# EAGLE design SmartWatch (EAGLE 7.4.0)
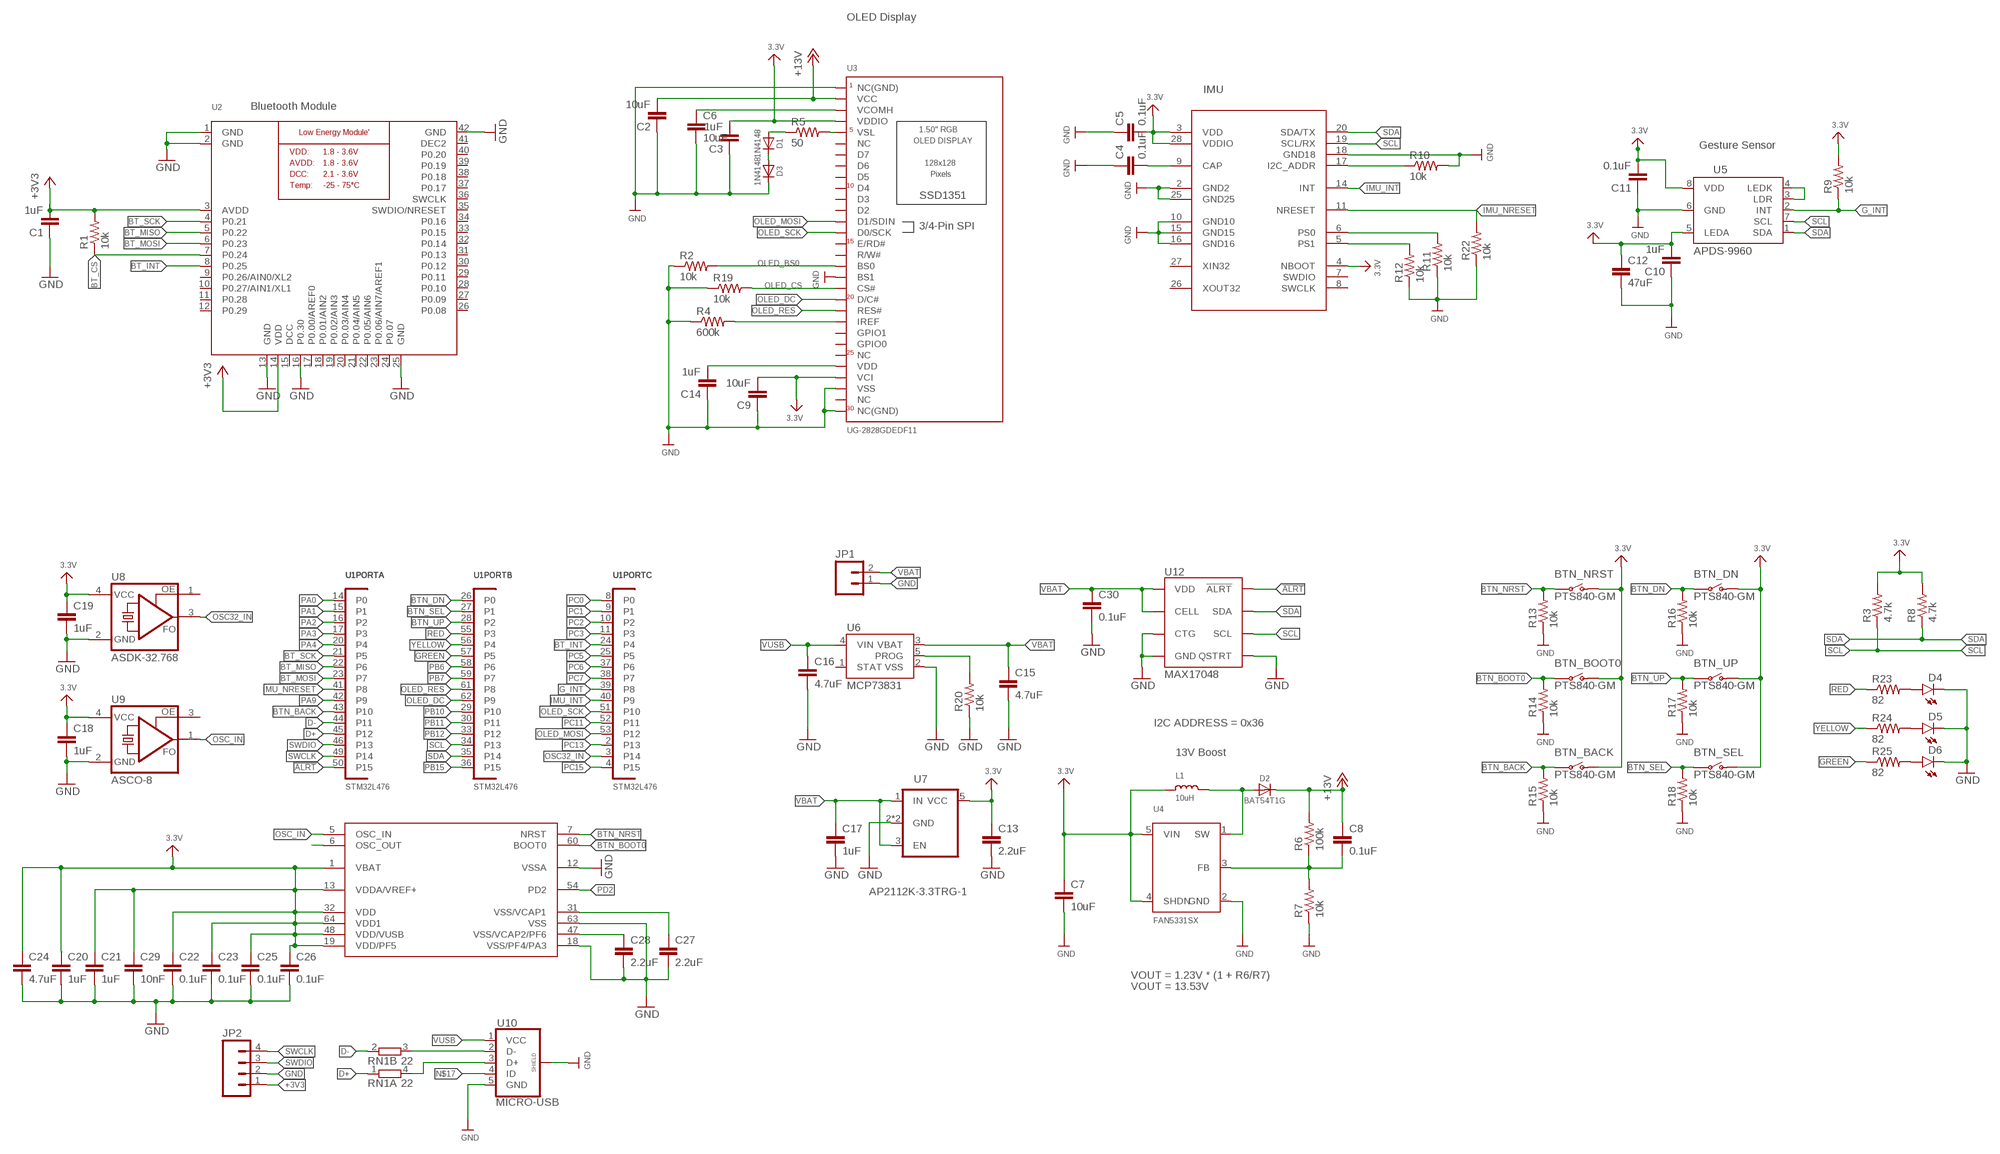
[diagram p0: schematic, sheet 1, part 1 of 2]
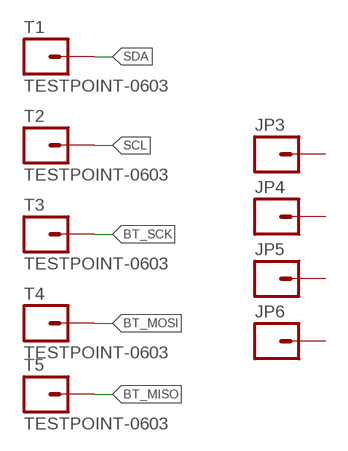
[diagram p1: schematic, sheet 1, part 2 of 2]

## Parts
BTN_BACK  PTS840-GM  [PTS840-GM]
BTN_BOOT0  PTS840-GM  [PTS840-GM]
BTN_DN  PTS840-GM  [PTS840-GM]
BTN_NRST  PTS840-GM  [PTS840-GM]
BTN_SEL  PTS840-GM  [PTS840-GM]
BTN_UP  PTS840-GM  [PTS840-GM]
C1  1uF  C-EUC0603  [C0603]
C2  10uF  C-EUC0603  [C0603]
C3  1uF  C-EUC0603  [C0603]
C4  0.1uF  C-EUC0603  [C0603]
C5  0.1uF  C-EUC0603  [C0603]
C6  10uF  C-EUC0603  [C0603]
C7  10uF  C-EUC0603  [C0603]
C8  0.1uF  C-EUC0603  [C0603]
C9  10uF  C-EUC0603  [C0603]
C10  1uF  C-EUC0603  [C0603]
C11  0.1uF  C-EUC0603  [C0603]
C12  47uF  C-EUC1206  [C1206]
C13  2.2uF  C-EUC0603  [C0603]
C14  1uF  C-EUC0603  [C0603]
C15  4.7uF  C-EUC0603  [C0603]
C16  4.7uF  C-EUC0603  [C0603]
C17  1uF  C-EUC0603  [C0603]
C18  1uF  C-EUC0603  [C0603]
C19  1uF  C-EUC0603  [C0603]
C20  1uF  C-EUC0603  [C0603]
C21  1uF  C-EUC0603  [C0603]
C22  0.1uF  C-EUC0603  [C0603]
C23  0.1uF  C-EUC0603  [C0603]
C24  4.7uF  C-EUC0603  [C0603]
C25  0.1uF  C-EUC0603  [C0603]
C26  0.1uF  C-EUC0603  [C0603]
C27  2.2uF  C-EUC0603  [C0603]
C28  2.2uF  C-EUC0603  [C0603]
C29  10nF  C-EUC0603  [C0603]
C30  0.1uF  C-EUC0603  [C0603]
D1  1N4148  DIODESOD-323  [SOD-323]
D2  BAT54T1G  DIODESOD-123  [SOD-123]
D3  1N4148  DIODESOD-323  [SOD-323]
D4  LED0603  [LED-0603]
D5  LED0603  [LED-0603]
D6  LED0603  [LED-0603]
JP1  M021X02_NO_SILK  [1X02_NO_SILK]
JP2  M04NO_SILK_ALL_ROUND  [1X04_NO_SILK_ALL_ROUND]
JP3  M01PTH_NO_SILK_YES_STOP  [1X01_NO_SILK]
JP4  M01PTH_NO_SILK_YES_STOP  [1X01_NO_SILK]
JP5  M01PTH_NO_SILK_YES_STOP  [1X01_NO_SILK]
JP6  M01PTH_NO_SILK_YES_STOP  [1X01_NO_SILK]
L1  10uH  INDUCTOR  [INDUCTOR_1007]
R1  10k  R-US_R0603  [R0603]
R2  10k  R-US_R0603  [R0603]
R3  4.7k  R-US_R0603  [R0603]
R4  600k  R-US_R0603  [R0603]
R5  50  R-US_R0603  [R0603]
R6  100k  R-US_R0603  [R0603]
R7  10k  R-US_R0603  [R0603]
R8  4.7k  R-US_R0603  [R0603]
R9  10k  R-US_R0603  [R0603]
R10  10k  R-US_R0603  [R0603]
R11  10k  R-US_R0603  [R0603]
R12  10k  R-US_R0603  [R0603]
R13  10k  R-US_R0603  [R0603]
R14  10k  R-US_R0603  [R0603]
R15  10k  R-US_R0603  [R0603]
R16  10k  R-US_R0603  [R0603]
R17  10k  R-US_R0603  [R0603]
R18  10k  R-US_R0603  [R0603]
R19  10k  R-US_R0603  [R0603]
R20  10k  R-US_R0603  [R0603]
R22  10k  R-US_R0603  [R0603]
R23  82  R-US_R0603  [R0603]
R24  82  R-US_R0603  [R0603]
R25  82  R-US_R0603  [R0603]
RN1  22  2R-NEXBV4V  [EXBV4V]
T1  TESTPOINT-0603  [TESTPOINT-0603]
T2  TESTPOINT-0603  [TESTPOINT-0603]
T3  TESTPOINT-0603  [TESTPOINT-0603]
T4  TESTPOINT-0603  [TESTPOINT-0603]
T5  TESTPOINT-0603  [TESTPOINT-0603]
U1  STM32L476  [TQFP64-10X10]
U2  NRF51822_MODULE_MDBT40  [BLE_MODULE_RAYTAC_MDBT40]
U3  UG-2828GDEDF11  DISP_OLED_UG-2828GDEDF11BOTTOM  [FPC_XF2M-3015-1A]
U4  FAN5331SX  FAN5331  [SOT23-5$1]
U5  APDS-9960  [APDS-9960]
U6  MCP73831  [SOT23-5]
U7  AP2112K-3.3TRG-1  LDO-TPS78233  [SOT23-5]
U8  ASDK-32.768  [ASDK-32.768]
U9  ASCO-8  [ASCO-8]
U10  MICRO-USB  [MICRO-USB]
U11  BNO055  [LGA28]
U12  MAX17048  MAX17048DFN8  [DFN-8]

## Nets
13V: C2.2 C8.1 D2.C R6.2 U3.P$2(VCC) ; supply symbol labelled +13V
!ALRT: U1.50(PORTA:P15) U12.P$5(!ALRT)
+3V3: BTN_BACK.3 BTN_BACK.4 BTN_BOOT0.3 BTN_BOOT0.4 BTN_DN.3 BTN_DN.4 BTN_NRST.3 BTN_NRST.4 BTN_SEL.3 BTN_SEL.4 BTN_UP.3 BTN_UP.4 C1.2 C3.2 C5.2 C7.1 C9.2 C10.2 C11.2 C12.1 C13.1 C18.1 C19.1 C20.1 C21.1 C22.1 C23.1 C24.1 C25.1 C26.1 C29.1 JP2.1 L1.P$1 R1.2 R3.2 R8.2 R9.2 U1.1(VBAT) U1.13(VDDA/VREF+) U1.19(VDD/PF5) U1.32(VDD) U1.48(VDD/VUSB) U1.64(VDD1) U2.3(AVDD) U2.14(VDD) U3.P$4(VDDIO) U3.P$27(VCI) U4.4(SHDN) U4.5(VIN) U5.5(LEDA) U5.8(VDD) U7.5(VCC) U8.4(VCC) U9.4(VCC) U11.3(VDD) U11.4(NBOOT) U11.28(VDDIO) ; supply symbol labelled 3.3V
BT_CS: R1.1 U2.7(P0.24)
BT_INT: U1.24(PORTC:P4) U2.8(P0.25)
BT_MISO: T5.1 U1.22(PORTA:P6) U2.5(P0.22)
BT_MOSI: T4.1 U1.23(PORTA:P7) U2.6(P0.23)
BT_SCK: T3.1 U1.21(PORTA:P5) U2.4(P0.21)
BTN_BACK: BTN_BACK.1 BTN_BACK.2 R15.2 U1.43(PORTA:P10)
BTN_BOOT0: BTN_BOOT0.1 BTN_BOOT0.2 R14.2 U1.60(BOOT0)
BTN_DN: BTN_DN.1 BTN_DN.2 R16.2 U1.26(PORTB:P0)
BTN_NRST: BTN_NRST.1 BTN_NRST.2 R13.2 U1.7(NRST)
BTN_SEL: BTN_SEL.1 BTN_SEL.2 R18.2 U1.27(PORTB:P1)
BTN_UP: BTN_UP.1 BTN_UP.2 R17.2 U1.28(PORTB:P2)
D+: RN1.1 U1.45(PORTA:P12)
D-: RN1.2 U1.44(PORTA:P11)
G_INT: R9.1 U1.39(PORTC:P8) U5.2(INT)
GND: C1.1 C2.1 C3.1 C4.1 C5.1 C6.2 C7.2 C9.1 C10.1 C11.1 C12.2 C13.2 C14.1 C15.2 C16.2 C17.2 C18.2 C19.2 C20.2 C21.2 C22.2 C23.2 C24.2 C25.2 C26.2 C27.2 C28.2 C29.2 C30.2 D3.C D4.C D5.C D6.C JP1.1 JP2.2 R2.1 R4.1 R7.1 R10.2 R11.1 R12.1 R13.1 R14.1 R15.1 R16.1 R17.1 R18.1 R19.1 R20.1 R22.1 U1.12(VSSA) U1.18(VSS/PF4/PA3) U1.63(VSS) U2.1(GND) U2.2(GND) U2.13(GND) U2.16(P0.30) U2.25(GND) U2.42(GND) U3.P$1(NC(GND)) U3.P$18(BS1) U3.P$28(VSS) U3.P$30(NC(GND)) U4.2(GND) U5.6(GND) U6.2(VSS) U7.2(GND) U7.4(GND) U8.2(GND) U9.2(GND) U10.5(GND) U10.6(SHIELD) U10.7(SHIELD) U10.8(SHIELD) U10.9(SHIELD) U10.10(SHIELD) U10.11(SHIELD) U11.2(GND2) U11.10(GND10) U11.15(GND15) U11.16(GND16) U11.18(GND18) U11.25(GND25) U12.P$1(CTG) U12.P$4(GND) U12.P$6(QSTRT) U12.P$9(GND)
GREEN: R25.1 U1.57(PORTB:P5)
ID: RN1.4 U10.3(D+)
IMU_INT: U1.40(PORTC:P9) U11.14(INT)
IMU_NRESET: R22.2 U1.41(PORTA:P8) U11.11(NRESET)
N$1: R4.2 U3.P$22(IREF)
N$2: C14.2 U3.P$26(VDD)
N$3: R10.1 U11.17(I2C_ADDR)
N$4: C4.2 U11.9(CAP)
N$5: D2.A L1.P$2 U4.1(SW)
N$6: R5.2 U3.P$5(VSL)
N$7: D1.A R5.1
N$8: C8.2 R6.1 R7.2 U4.3(FB)
N$9: U5.3(LDR) U5.4(LEDK)
N$10: RN1.3 U10.2(D-)
N$11: D1.C D3.A
N$13: R12.2 U11.5(PS1)
N$14: R11.2 U11.6(PS0)
N$15: U1.6(OSC_OUT)
N$16: D4.A R23.2
N$17: U10.4(ID)
N$18: D5.A R24.2
N$19: D6.A R25.2
N$27: C27.1 U1.31(VSS/VCAP1)
N$29: C28.1 U1.47(VSS/VCAP2/PF6)
OLED_BS0: R2.2 U3.P$17(BS0)
OLED_CS: R19.2 U3.P$19(CS#)
OLED_DC: U1.62(PORTB:P9) U3.P$20(D/C#)
OLED_MOSI: U1.53(PORTC:P12) U3.P$13(D1/SDIN)
OLED_RES: U1.61(PORTB:P8) U3.P$21(RES#)
OLED_SCK: U1.51(PORTC:P10) U3.P$14(D0/SCK)
OSC32_IN: U1.3(PORTC:P14) U8.3(FO)
OSC_IN: U1.5(OSC_IN) U9.1(FO)
PA0: U1.14(PORTA:P0)
PA1: U1.15(PORTA:P1)
PA2: U1.16(PORTA:P2)
PA3: U1.17(PORTA:P3)
PA4: U1.20(PORTA:P4)
PA9: U1.42(PORTA:P9)
PB6: U1.58(PORTB:P6)
PB7: U1.59(PORTB:P7)
PB10: U1.29(PORTB:P10)
PB11: U1.30(PORTB:P11)
PB12: U1.33(PORTB:P12)
PB15: U1.36(PORTB:P15)
PC0: U1.8(PORTC:P0)
PC1: U1.9(PORTC:P1)
PC2: U1.10(PORTC:P2)
PC3: U1.11(PORTC:P3)
PC5: U1.25(PORTC:P5)
PC6: U1.37(PORTC:P6)
PC7: U1.38(PORTC:P7)
PC11: U1.52(PORTC:P11)
PC13: U1.2(PORTC:P13)
PC15: U1.4(PORTC:P15)
PD2: U1.54(PD2)
PROG: R20.2 U6.5(PROG)
RED: R23.1 U1.55(PORTB:P3)
SCL: R3.1 T2.1 U1.34(PORTB:P13) U5.7(SCL) U11.19(SCL/RX) U12.P$7(SCL)
SDA: R8.1 T1.1 U1.35(PORTB:P14) U5.1(SDA) U11.20(SDA/TX) U12.P$8(SDA)
SWCLK: JP2.4 U1.49(PORTA:P14)
SWDIO: JP2.3 U1.46(PORTA:P13)
VBAT: C15.1 C17.1 C30.1 JP1.2 U6.3(VBAT) U7.1(IN) U7.3(EN) U12.P$2(CELL) U12.P$3(VDD)
VCOMH1: C6.1 U3.P$3(VCOMH)
VUSB: C16.1 U6.4(VIN) U10.1(VCC)
YELLOW: R24.1 U1.56(PORTB:P4)
Unconnected: JP3.1 JP4.1 JP5.1 JP6.1 U2.9(P0.26/AIN0/XL2) U2.10(P0.27/AIN1/XL1) U2.11(P0.28) U2.12(P0.29) U2.17(P0.00/AREF0) U2.18(P0.01/AIN2) U2.19(P0.02/AIN3) U2.20(P0.03/AIN4) U2.21(P0.04/AIN5) U2.22(P0.05/AIN6) U2.23(P0.06/AIN7/AREF1) U2.24(P0.07) U2.26(P0.08) U2.27(P0.09) U2.28(P0.10) U2.29(P0.11) U2.30(P0.12) U2.31(P0.13) U2.32(P0.14) U2.33(P0.15) U2.34(P0.16) U2.35(SWDIO/NRESET) U2.36(SWCLK) U2.37(P0.17) U2.38(P0.18) U2.39(P0.19) U2.40(P0.20) U3.P$6(NC) U3.P$7(D7) U3.P$8(D6) U3.P$9(D5) U3.P$10(D4) U3.P$11(D3) U3.P$12(D2) U3.P$15(E/RD#) U3.P$16(R/W#) U3.P$23(GPIO1) U3.P$24(GPIO0) U3.P$25(NC) U3.P$29(NC) U6.1(STAT) U8.1(OE) U9.3(OE) U11.7(SWDIO) U11.8(SWCLK) U11.26(XOUT32) U11.27(XIN32)

## Notes on the sheet
- OLED Display
- IMU
- Bluetooth Module
- Gesture Sensor
- I2C ADDRESS = 0x36
- 13V Boost
- VOUT = 1.23V * (1 + R6/R7)
- VOUT = 13.53V

## Power pins joined to a net without a drawn wire
DCC: U2.15(DCC)
DEC2: U2.41(DEC2)

## Library data of the parts
BTN_BACK BTN_BOOT0 BTN_DN BTN_NRST BTN_SEL BTN_UP = SmartWatch:PTS840-GM
C1-C14 = resistor:C-EU: CAPACITOR, European symbol
C15 C16 C20-C30 = resistor:C-EU: CAPACITOR, European symbol; PROD_ID: CAP-08280
C17-C19 = resistor:C-EU: CAPACITOR, European symbol; PROD_ID: CAP-00868
D1-D3 = microbuilder:DIODE: Diode SMA Model Volts Amps Type Vf Ir Digikey # Notes SSA34-E3 40V 3A Schottky 480mV @ 3A 200uA @ 40V SSA34-E3/61TGITR-ND CDBA120-G 20V 1A Schottky 500mV @ 1A 500uA @ 20V 641-1014-6-ND REEL MBRA210 10V 2A Schottky 350mV @ 2A 700uA @ 10V MBRA210LT3 SOD-123 Model Volts Amps Type Vf Ir Order # Notes BAT54T1G 30V 200mA Schottky 800mV @ 200mA 2uA @ 25V BAT54T1GOSTR-ND B0530W 30V 500mA Schottky 430mV @ 500mA 130uA @ 30V B0530W-FDICT-ND REEL MBR120 20V 1A Schottky 340mV @ 1A MBR120VLSFT1GOSCT-ND SOD-323 Model Volts Amps Type Vf Ir Order # Notes PMEG2005EJ 20V 500mA Schottky 355mV @ 500mA 568-4110-1-ND ZLLS410 10V 570mA Schottky 380mV @ 570mA ZLLS410CT-ND 1N4148WS 75V 150mA Silicon/Simple 1V 1N4148WSFSCT-ND REEL SOD-523 Model Volts Amps Type Vf Ir Order # Notes BAT54XV2 30V 200mA Schottky 0.8V @ 100mA BAT54XV2CT-ND TB751S 30V 30mA Schottky RB751S-40TE61CT-ND SOT23-R/W (R = Solder Paste/Reflow Ovens, W = Hand-Soldering) Model Volts Amps Type Vf Ir Order # Notes BAT54FILM 40V 300mA Schottky 497-7162-1-ND POWERDI-5 Model Volts Amps Type Vf Ir Order # Notes PDS560 60V 5A Schottky 670mV @ 5A 150uA @ 60V PDS560DICT-ND
D4-D6 = SparkFun-LED:LED: LEDs Standard schematic elements and footprints for 5mm, 3mm, 1206, and 0603 sized LEDs. 5mm - Spark Fun Electronics SKU : COM-00529 (and others)
JP1 = SparkFun-Connectors:M02: Standard 2-pin 0.1" header. Use with - straight break away headers ( PRT-00116) - right angle break away headers (PRT-00553) - swiss pins (PRT-00743) - machine pins (PRT-00117) - female headers (PRT-00115) Molex polarized connector foot print use with: PRT-08233 with associated crimp pins and housings. 2.54_SCREWTERM for use with PRT-10571. 3.5mm Screw Terminal footprints for PRT-08084 5mm Screw Terminal footprints for use with PRT-08432
JP2 = SparkFun-Connectors:M04: Header 4 Standard 4-pin 0.1" header. Use with straight break away headers (SKU : PRT-00116), right angle break away headers (PRT-00553), swiss pins (PRT-00743), machine pins (PRT-00117), and female headers (PRT-00115). Molex polarized connector foot print use with SKU : PRT-08231 with associated crimp pins and housings. 1MM SMD Version SKU: PRT-10208
JP3-JP6 = SparkFun-Connectors:M01: Header 1 Standard 1-pin 0.1" header. Use with straight break away headers (SKU : PRT-00116), right angle break away headers (PRT-00553), swiss pins (PRT-00743), machine pins (PRT-00117), and female headers (PRT-00115).
L1 = microbuilder:INDUCTOR: Inductors 0603: 10nH Ceramic Inductor - microwire antenna/RF (Digikey: 712-1434-2-ND) 0805: 560nH Ceramic Inductor - RF (Digikey: 553-1047-1-ND) 270nH Ceramic Inductor - Q = 40@250MHz, +-5%, 1 Ohm DC Resistance (Digikey: 535-10506-2-ND) 1007 (2518 Metric) SMT: 10µH 10% 250mOhm 820mA 1007 Inductor (Digikey: 587-2189-1-ND) 22µH 10% 500mOhm 580mA 1007 Inductor (Digikey: 587-2190-1-ND) 47µH 10% 950mOhm 420mA 1007 Inductor (Digikey: 587-2191-1-ND) 47µH 5% 100mOhm 1A 1008 Inductor (Digikey: 732-1816-1-ND) 5.0x5.0mm (Taiyo Yuden NR5040 Series) 6.8µH 20% 2.3A 64mOhm Inductor (Digikey: 587-2374-2-ND) 5.0x5.0mm (TDK VLC5045 Series) 4.7µH 20% 3.3A 34mOhm Inductor (Digikey: 445-6526-1-ND) 6.8µH 20% 2.7A 46mOhm Inductor (Digikey: 445-6527-1-ND) 6.0x6.0mm (TDK VLC6045 Series) 4.7µH 20% 3.8A 27mOhm Inductor (Digikey: 445-6538-2-ND) 6.8µH 20% 3A 41mOhm Inductor (Digikey: 445-6540-1-ND) 6.2µH 30% 2.2A 45mOhm Inductor (Digikey: SRR5028-6R2YCT-ND) - Not TDK VLC6045 but footprint should match 6.0x6.0mm (TDK SLF6045 Series) 6.8uH 30% 2A 33mOhm Inductor (Digikey: 445-4572-1-ND, Mouser: 810-SLF645T6R8N2R0PF) 6.0x6.0mm (Sumida CDRH5D28 Series) 6.2uH 30% 1.8A 45mOhm Inductor (Digikey: 308-1542-1-ND) Taiyo Yuden NR3015T2R2M - 2.2uH 20% 1.5A (Digikey: 587-1648-2-ND, Mouser: 963-NR3015T2R2M) - Used with TI TPS62172 CoilCraft RFID Transponder Coil - MA5532-AE (For use with AS3935 Lightning Sensor)
R1-R20 R22-R25 = resistor:R-US_: RESISTOR, American symbol
RN1 = MicroBoard:2R-N: Array Chip Resistor; DIGIKEY: RHM1381CT-ND; MF: Rohm Semiconductor; MPN: MNR12ERAPJ220
T1-T5 = SmartWatch:TESTPOINT-0603
U1 = SmartWatch:STM32L476
U2 = SmartWatch:NRF51822_MODULE_MDBT40: nRF51822 Bluetooth Low Energy Module
U3 = SmartWatch:DISP_OLED_UG-2828GDEDF11: 128x128 1.5" RGB OLED - UG-2828GDEDF11 30-Pin 0.5mm Pitch FPC Cable (Top+Bottom Contacts) - OMRON XF2M-3015-1A (Digikey: OR723TR-ND) This FPC connector has contacts on the top and bottom, but the appropriate pin needs to be selected depending on whether the OLED will be inserted right-side up (use the TOP pinout) or upside-down (use the BOTTOM pinout).
U4 = SmartWatch:FAN5331: FAN5331 - LED/OLED 20V Boost Converter Digikey: FAN5331SXCT-ND
U5 = SparkFun-Sensors:APDS-9960: Avago APDS-9960 digital proximity, ambient light, RGB, and gesture sensor.; PROD_ID: SEN-12005
U6 = SparkFun:MCP73831: Microchip's MCP73831 Miniature single cell, fully integrated Li-Ion, Li-polymer charge management controller http://ww1.microchip.com/downloads/en/DeviceDoc/21984a.pdf; PROD_ID: IC-09995
U7 = SparkFun-PowerIC:LDO-TPS78233: Voltage Regulator LDO 500nA Ground Current, 150mA, Ultra-Low Quiescent Current Low-Dropout Linear Regulator.; PROD_ID: VREG-12457
U8 = SmartWatch:ASDK-32.768
U9 = SmartWatch:ASCO-8
U10 = SmartWatch:MICRO-USB
U11 = SmartWatch:BNO055
U12 = SparkFun-DigitalIC:MAX17048: Micropower 1-Cell Li+ ModelGauge; PROD_ID: IC-12551

## Board
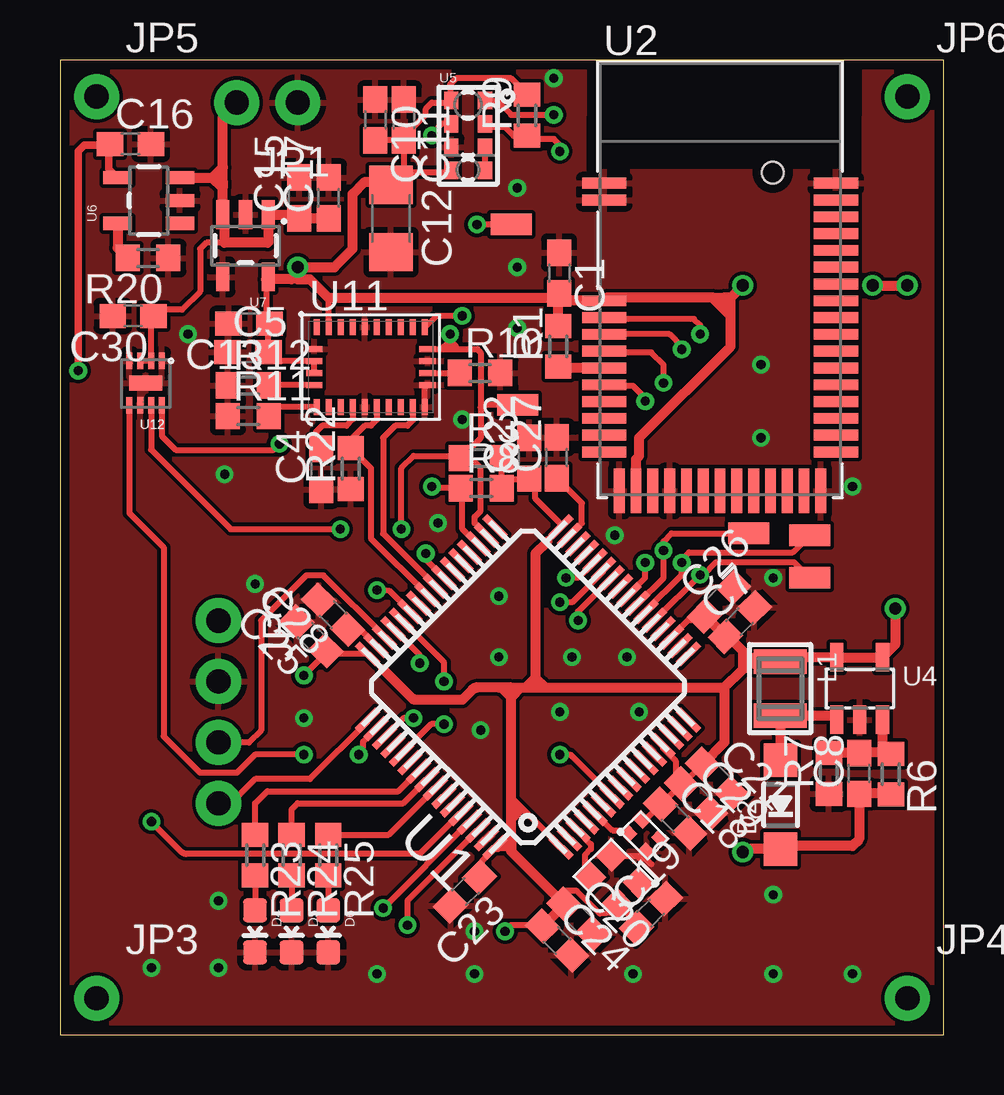
[diagram p2: board, top side]
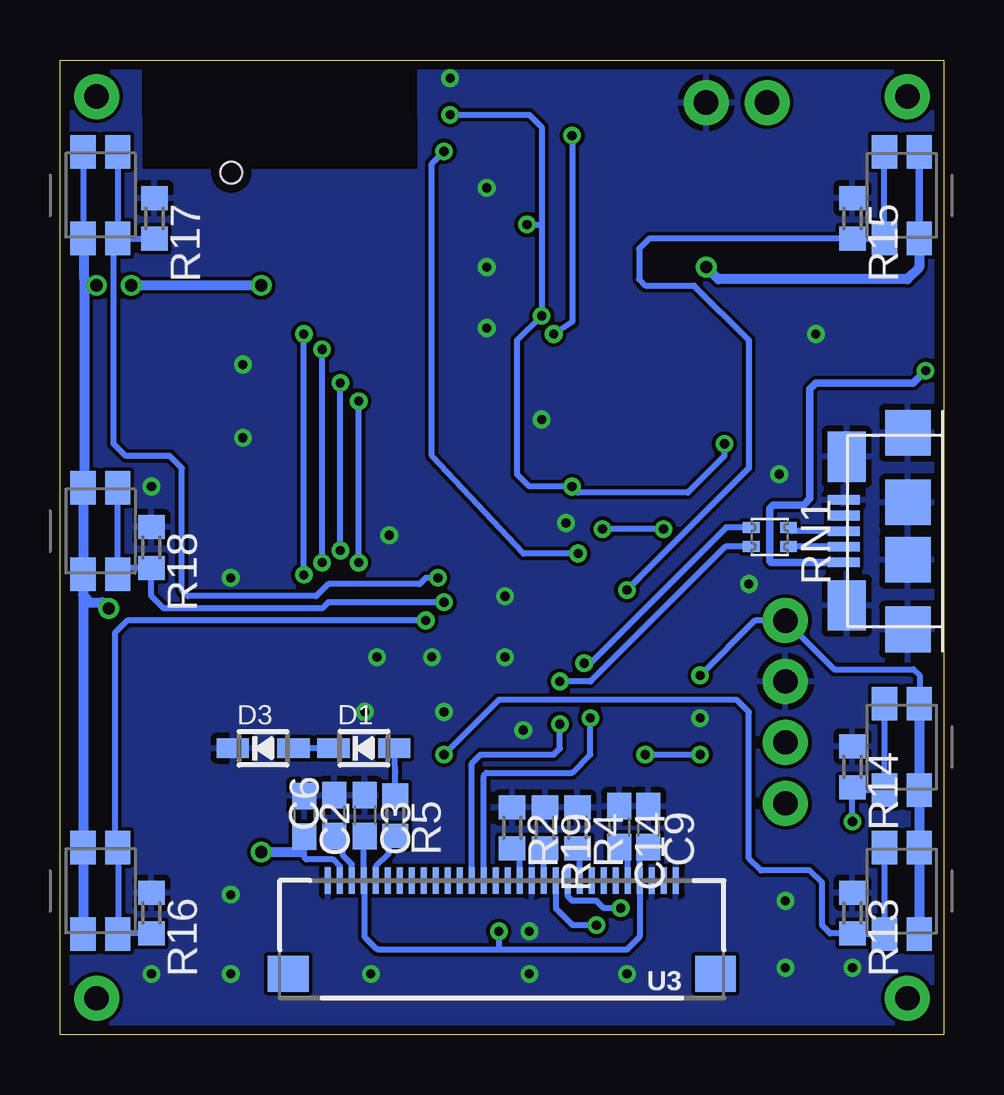
[diagram p3: board, bottom side, seen from below]

Size 36.83 x 40.64 mm. Coordinates in mm from the lower left corner, seen from the top.
Outline: 0,0 36.83,0 36.83,40.64 0,40.64 0,0
Copper layers (1*16): Top 0.0356mm / dielectric 1.5011mm / Bottom 0.0356mm
Design rules "LaenPCBOrder": minimum track width 6mil, minimum drill 13mil, track to track 6mil, track to pad 6mil, pad to pad 6mil, via to via 6mil, smd to smd 6mil, copper to edge 15mil, drill to drill 6mil, minimum pad ring 7mil, minimum via ring 7mil, stop-mask expansion 3mil, vias tented up to drill 0mil, thermal gap 10mil

### Footprints (pad centres in the part's own frame; a part is rotated, then mirrored left to right if it is on the bottom)
PTS840-GM = smd 1.4 x 1.05: 1 -1.8,0.725; 2 1.8,0.725; 3 -1.8,-0.725; 4 1.8,-0.725
C0603 = smd 1.1 x 1: 1 -0.85,0; 2 0.85,0
C1206 = smd 1.6 x 1.8: 1 -1.4,0; 2 1.4,0
SOD-323 = smd 1.35 x 0.8: A 1.27,0; C -1.27,0
SOD-123 = smd 1.4 x 1.4: A 1.85,0; C -1.85,0
LED-0603 = smd 1 x 1: A 0,-0.877; C 0,0.877
1X02_NO_SILK = drill 1.016 pad 1.88: 1 0,0; 2 2.54,0
1X04_NO_SILK_ALL_ROUND = drill 1.016 pad 1.88: 1 0,0; 2 2.54,0; 3 5.08,0; 4 7.62,0
1X01_NO_SILK = drill 1.016 pad 1.88: 1 0,0
INDUCTOR_1007 = smd 1.016 x 2.2: P$1 -1.127,0; P$2 1.127,0
R0603 = smd 1 x 1.1: 1 -0.85,0; 2 0.85,0
EXBV4V = smd 0.45 x 0.7: 1 -0.4,-0.775; 2 0.4,-0.775; 3 0.4,0.775; 4 -0.4,0.775
TESTPOINT-0603 = smd 1.7 x 0.9: 1 0,0
TQFP64-10X10 = smd 1.2 x 0.3: 1 -5.7,3.75; 2 -5.7,3.25; 3 -5.7,2.75; 4 -5.7,2.25; 5 -5.7,1.75; 6 -5.7,1.25; 7 -5.7,0.75; 8 -5.7,0.25; 9 -5.7,-0.25; 10 -5.7,-0.75; 11 -5.7,-1.25; 12 -5.7,-1.75; 13 -5.7,-2.25; 14 -5.7,-2.75; 15 -5.7,-3.25; 16 -5.7,-3.75; 33 5.7,-3.75; 34 5.7,-3.25; 35 5.7,-2.75; 36 5.7,-2.25; 37 5.7,-1.75; 38 5.7,-1.25; 39 5.7,-0.75; 40 5.7,-0.25; 41 5.7,0.25; 42 5.7,0.75; 43 5.7,1.25; 44 5.7,1.75; 45 5.7,2.25; 46 5.7,2.75; 47 5.7,3.25; 48 5.7,3.75 | smd 0.3 x 1.2: 17 -3.75,-5.7; 18 -3.25,-5.7; 19 -2.75,-5.7; 20 -2.25,-5.7; 21 -1.75,-5.7; 22 -1.25,-5.7; 23 -0.75,-5.7; 24 -0.25,-5.7; 25 0.25,-5.7; 26 0.75,-5.7; 27 1.25,-5.7; 28 1.75,-5.7; 29 2.25,-5.7; 30 2.75,-5.7; 31 3.25,-5.7; 32 3.75,-5.7; 49 3.75,5.7; 50 3.25,5.7; 51 2.75,5.7; 52 2.25,5.7; 53 1.75,5.7; 54 1.25,5.7; 55 0.75,5.7; 56 0.25,5.7; 57 -0.25,5.7; 58 -0.75,5.7; 59 -1.25,5.7; 60 -1.75,5.7; 61 -2.25,5.7; 62 -2.75,5.7; 63 -3.25,5.7; 64 -3.75,5.7
BLE_MODULE_RAYTAC_MDBT40 = smd 1.85 x 0.45: 1 -4.825,4; 2 -4.825,3.3; 3 -4.825,-0.9; 4 -4.825,-1.6; 5 -4.825,-2.3; 6 -4.825,-3; 7 -4.825,-3.7; 8 -4.825,-4.4; 9 -4.825,-5.1; 10 -4.825,-5.8; 11 -4.825,-6.5; 12 -4.825,-7.2; 26 4.825,-7.2; 27 4.825,-6.5; 28 4.825,-5.8; 29 4.825,-5.1; 30 4.825,-4.4; 31 4.825,-3.7; 32 4.825,-3; 33 4.825,-2.3; 34 4.825,-1.6; 35 4.825,-0.9; 36 4.825,-0.2; 37 4.825,0.5; 38 4.825,1.2; 39 4.825,1.9; 40 4.825,2.6; 41 4.825,3.3; 42 4.825,4 | smd 0.45 x 1.85: 13 -4.2,-8.825; 14 -3.5,-8.825; 15 -2.8,-8.825; 16 -2.1,-8.825; 17 -1.4,-8.825; 18 -0.7,-8.825; 19 0,-8.825; 20 0.7,-8.825; 21 1.4,-8.825; 22 2.1,-8.825; 23 2.8,-8.825; 24 3.5,-8.825; 25 4.2,-8.825 | hole 0.9: 2.2,4.45
FPC_XF2M-3015-1A = smd 0.25 x 1.1: P$1 7.25,-2.63; P$2 6.75,-2.63; P$3 6.25,-2.63; P$4 5.75,-2.63; P$5 5.25,-2.63; P$6 4.75,-2.63; P$7 4.25,-2.63; P$8 3.75,-2.63; P$9 3.25,-2.63; P$10 2.75,-2.63; P$11 2.25,-2.63; P$12 1.75,-2.63; P$13 1.25,-2.63; P$14 0.75,-2.63; P$15 0.25,-2.63; P$16 -0.25,-2.63; P$17 -0.75,-2.63; P$18 -1.25,-2.63; P$19 -1.75,-2.63; P$20 -2.25,-2.63; P$21 -2.75,-2.63; P$22 -3.25,-2.63; P$23 -3.75,-2.63; P$24 -4.25,-2.63; P$25 -4.75,-2.63; P$26 -5.25,-2.63; P$27 -5.75,-2.63; P$28 -6.25,-2.63; P$29 -6.75,-2.63; P$30 -7.25,-2.63 | smd 1.7 x 1.5: SUPPORT1 8.9,1.27; SUPPORT2 -8.9,1.27
SOT23-5$1 = smd 0.55 x 1.2: 1 -0.95,-1.3; 2 0,-1.3; 3 0.95,-1.3; 4 0.95,1.3; 5 -0.95,1.3
APDS-9960 = smd 0.6 x 0.72: 1 0.7,1.455; 2 0.7,0.485; 3 0.7,-0.485; 4 0.7,-1.455; 5 -0.7,-1.455; 6 -0.7,-0.485; 7 -0.7,0.485; 8 -0.7,1.455
SOT23-5 = smd 0.55 x 1.2: 1 -0.95,-1.3; 2 0,-1.3; 3 0.95,-1.3; 4 0.95,1.3; 5 -0.95,1.3
ASDK-32.768 = smd 1 x 0.9: 1 -0.812,-0.613; 2 0.812,-0.613; 3 0.812,0.613; 4 -0.812,0.613
ASCO-8 = smd 0.6 x 0.5: 1 -0.55,-0.4; 2 0.55,-0.4; 3 0.55,0.4; 4 -0.55,0.4
MICRO-USB = smd 0.4 x 1.35: 1 -1.3,2.675; 2 -0.65,2.675; 3 0,2.675; 4 0.65,2.675; 5 1.3,2.675 | smd 2.1 x 1.6: 6 -3.1,2.55; 7 3.1,2.55 | smd 1.9 x 1.9: 8 -4.1,0; 9 -1.2,0; 10 1.2,0; 11 4.1,0
LGA28 = smd 0.25 x 0.675: 1 -2.25,1.663; 6 -2.25,-1.663; 7 -1.75,-1.663; 8 -1.25,-1.663; 9 -0.75,-1.663; 10 -0.25,-1.663; 11 0.25,-1.663; 12 0.75,-1.663; 13 1.25,-1.663; 14 1.75,-1.663; 15 2.25,-1.663; 20 2.25,1.663; 21 1.75,1.663; 22 1.25,1.663; 23 0.75,1.663; 24 0.25,1.663; 25 -0.25,1.663; 26 -0.75,1.663; 27 -1.25,1.663; 28 -1.75,1.663 | smd 0.675 x 0.25: 2 -2.362,0.75; 3 -2.362,0.25; 4 -2.362,-0.25; 5 -2.362,-0.75; 16 2.362,-0.75; 17 2.362,-0.25; 18 2.362,0.25; 19 2.362,0.75
DFN-8 = smd 0.25 x 0.7: P$1 -0.688,-0.92; P$2 -0.238,-0.92; P$3 0.212,-0.92; P$4 0.662,-0.92; P$5 0.662,0.93; P$6 0.212,0.93; P$7 -0.238,0.93; P$8 -0.688,0.93 | smd 1.37 x 0.64: P$9 -0.013,0.005

### Placement (x,y rotation side)
BTN_BACK  1.75,35 90 bottom
BTN_BOOT0  1.75,12 90 bottom
BTN_DN  35.15,6 270 bottom
BTN_NRST  1.75,6 90 bottom
BTN_SEL  35.15,21 270 bottom
BTN_UP  35.15,35 270 bottom
C1  20.8,31.76 270 top
C2  26.66,9.11 270 bottom
C3  24.13,9.14 270 bottom
C4  10.89,23.58 90 top
C5  7.83,28.47 0 top
C6  25.4,9.14 90 bottom
C7  28.32,17.21 45 top
C8  33.3,10.9 90 top
C9  12.31,8.68 270 bottom
C10  13.14,38.14 270 top
C11  14.33,38.14 270 top
C12  13.79,34.03 270 top
C13  7.87,29.64 180 top
C14  13.53,8.68 270 bottom
C15  9.97,34.89 90 top
C16  2.94,37.13 0 top
C17  11.2,34.89 90 top
C18  25.63,9.01 315 top
C19  24.62,5.08 45 top
C20  21.6,4.85 315 top
C21  27.37,10.68 315 top
C22  19.55,24.04 90 top
C23  16.88,5.98 225 top
C24  20.71,3.93 315 top
C25  10.47,16.62 135 top
C26  27.46,18.06 45 top
C27  20.7,24.06 90 top
C28  11.38,17.52 135 top
C29  26.5,9.86 315 top
C30  3.05,29.97 180 top
D1  24.17,11.95 0 bottom
D2  30.02,9.6 90 top
D3  28.36,11.95 0 bottom
D4  8.13,4.32 180 top
D5  9.65,4.32 180 top
D6  11.18,4.32 180 top
JP1  9.91,38.86 180 top
JP2  6.6,17.27 270 top
JP3  1.52,1.52 0 top
JP4  35.31,1.52 0 top
JP5  1.52,39.12 0 top
JP6  35.31,39.12 0 top
L1  30.01,14.44 270 top
R1  20.76,28.71 90 top
R2  17.99,8.63 270 bottom
R3  17.55,24.05 0 top
R4  15.27,8.63 270 bottom
R5  22.86,9.14 270 bottom
R6  34.62,10.87 270 top
R7  32.04,10.9 90 top
R8  17.55,22.79 0 top
R9  19.46,38.33 90 top
R10  17.5,27.59 0 top
R11  7.85,25.8 0 top
R12  7.85,27.07 0 top
R13  3.81,5.08 270 bottom
R14  3.81,11.18 270 bottom
R15  3.81,34.04 270 bottom
R16  33.02,5.08 270 bottom
R17  32.89,34.04 270 bottom
R18  33.02,20.32 270 bottom
R19  16.62,8.63 270 bottom
R20  3.67,32.39 180 top
R22  12.12,23.61 90 top
R23  8.13,7.49 270 top
R24  9.65,7.49 270 top
R25  11.18,7.49 270 top
RN1  7.25,20.75 270 bottom
T1  18.8,33.78 180 top
T2  19.08,26.26 0 top
T3  31.24,19.05 180 top
T4  28.7,20.9 0 top
T5  31.24,20.83 180 top
U1  19.5,14.5 135 top
U2  27.5,31.5 0 top
U3  18.41,3.81 180 bottom
U4  33.32,14.44 0 top
U5  17,37.49 0 top
U6  3.7,34.78 90 top
U7  7.73,32.9 180 top
U8  23.1,6.46 135 top
U9  24.34,8.31 315 top
U10  1.5,21 90 bottom
U11  12.95,27.84 0 top
U12  3.56,27.18 180 top

### Tracks (layer width: path | path; a pad name or v marks a point on that pad's centre or on a via)
13V  (via drill 0.51)
  Top 0.406: v28.45,7.62 28.57,7.75 D2.C 30.15,7.87 33.02,7.87 33.3,8.15 C8.1 33.35,10.09 34.54,10.09 R6.2
  Bottom 0.254: U3.P$2 25.16,7.03 25.45,7.32 26.57,7.32 26.64,7.39 26.64,8.05 C2.2
  Bottom 0.406: v28.45,7.62 26.84,7.62 C2.2
!ALRT  (via drill 0.38)
  Top 0.254: U1.50 12.62,12.22 12.62,11.76 v12.45,11.68 | v10.16,11.68 8.13,11.68 7.37,10.92 5.84,10.92 4.32,12.45 4.32,20.32 2.89,21.74 U12.P$5
  Bottom 0.254: v12.45,11.68 v10.16,11.68
+3V3  (via drill 0.38, 0.51)
  Top 0.254: C29.1 24.83,9.39 24.83,9.34 C18.1 24.4,8.99 U9.4 | C29.1 25.8,10.31 C21.1 | U1.13 25.12,11.96 25.65,11.43 25.65,10.4 C29.1 | U1.19 26.19,17.3 26.31,17.3 C26.1 | U1.32 20.88,21.29 19.81,22.35 19.81,22.93 C22.1 19.78,23.17 18.77,23.17 R8.2 R3.2 | C11.2 C10.2 | R9.2 19.46,39.21 18.8,39.88 16.51,39.88 16.26,39.62 16.26,38.99 U5.8 16.21,38.86 15.49,38.86 15.24,38.61 15.24,38.35 14.33,37.45 C11.2 | C11.2 14.33,35.97 | 14.33,35.97 C12.1 | 18.23,7.82 U1.64 18.12,7.78 17.58,7.24 17.58,6.67 C23.1 | 13.46,15.24 arc-45 13.45,15.24 U1.48 11.21,15.88 C25.1 11.07,15.9 v10.16,14.99 | 18.29,14.48 18.8,13.97 19.3,14.48 19.81,14.99 20.32,14.48 | U1.32 20.88,21.13 | 20.32,20.57 20.32,20.62 U1.32 | U11.28 11.2,30.71 11.18,30.73 | U11.4 U11.3 9.12,28.09 C5.2 8.68,29.71 C13.1 8.58,29.94 8.58,31.5 | 14.33,35.97 16.23,35.97 U5.5 | C24.1 20.06,4.57 18.8,4.57 v18.54,4.32 | U1.1 19.3,9.4 | 19.3,9.4 19.05,9.65 | 19.05,9.65 18.8,9.91 | 18.8,9.4 19.05,9.65 | 19.3,9.4 18.8,8.89 18.8,9.14 19.05,9.4 | C19.1 24.07,4.63 U8.4 23.11,5.32 23.11,5.08 22.5,5.05 21.54,5.99 20.98,5.99 20.83,5.84 20.83,5.62 C20.1
  Top 0.406: U2.14 24,24 24.13,24.13 24.13,24.89 27.94,28.7 27.94,29.97 | 27.94,29.97 27.18,30.73 | 27.18,30.73 22.81,30.73 U2.3 20.84,30.6 C1.2 | 21.06,30.87 C1.2 | R1.2 20.76,30.87 C1.2 | 8.58,31.5 U7.5 8.78,31.5 9.65,31.5 9.91,31.75 v9.91,32 | v9.91,32 9.91,31.5 10.41,31.5 11.18,30.73 20.88,30.73 C1.2 | 27.94,29.97 27.94,30.48 | 27.94,30.73 27.69,30.73 | 27.18,30.73 27.69,30.73 | 27.69,30.73 27.94,30.48 | 27.94,30.48 27.94,30.73 | 27.94,30.73 v28.45,31.24 | v33.86,31.24 v35.31,31.24 | v34.8,17.78 34.8,16.27 U4.4 U4.5 30.18,15.74 L1.P$1 29.82,15.75 28.96,15.75 28.83,15.62 | C26.1 26.74,17.64 C7.1 27.74,16.71 28.45,16 | 27.69,14.48 27.69,12.19 C21.1 | 18.23,7.82 18.29,7.87 | 18.29,7.87 18.8,8.38 | 18.8,8.38 18.8,8.89 18.8,9.4 18.8,9.91 18.8,13.97 18.8,14.48 | 18.8,14.48 19.3,14.48 19.81,14.48 | 19.81,14.48 20.32,14.48 27.69,14.48 | 27.69,14.48 28.45,15.24 | 28.45,15.24 28.83,15.62 | 28.45,16 28.83,15.62 | 28.45,16 28.45,15.49 | 28.45,15.49 28.45,15.24 | 28.45,15.49 29.21,15.49 | 18.8,14.48 18.29,14.48 17.38,14.48 arc45 17.2,14.4 16.76,13.97 14.84,13.97 arc-45 14.66,14.04 13.46,15.24 | 19.81,14.48 19.81,14.99 19.81,20.07 20.32,20.57 | v9.91,32 11.43,32 12.19,32.77 12.19,35.05 12.7,35.56 13.66,35.56 C12.1 | 18.8,8.38 18.8,7.87 | 18.8,7.87 18.8,7.66 C20.1 21,5.42 C24.1 | 18.29,7.87 18.8,7.87
  Bottom 0.254: C9.2 12.66,7.47 U3.P$27 12.66,4.2 arc45 12.74,4.03 13.21,3.56 18.54,3.56 | C3.2 24.16,8.01 U3.P$4 arc45 24.13,6.36 24.13,4.06 23.7,3.63 arc-45 23.52,3.56 18.54,3.56 | BTN_UP.3 BTN_UP.4 | 9.91,14.99 v10.16,14.99 7.87,17.27 JP2.1 4.57,15.24 1.27,15.24 1.02,14.99 1.02,13.81 BTN_BOOT0.4 | v18.54,4.32 18.54,3.56
  Bottom 0.305: BTN_BACK.3 BTN_BACK.4
  Bottom 0.406: BTN_BACK.3 1.03,31.99 1.52,31.5 9.4,31.5 v9.91,32 | v28.45,31.24 v33.86,31.24 | v35.31,31.24 35.56,31.24 | 35.56,31.24 35.81,31.5 | 35.81,31.5 35.81,33.14 BTN_UP.4 | 35.81,31.5 35.81,30.99 | 35.56,31.24 35.81,30.99 | 35.81,30.99 35.81,22.86 BTN_SEL.3 BTN_SEL.4 | BTN_SEL.4 BTN_DN.3 BTN_DN.4 | BTN_SEL.4 35.87,18.34 35.56,18.03 | 35.81,18.03 35.56,18.03 | 35.56,18.03 35.05,18.03 v34.8,17.78 | BTN_BOOT0.4 BTN_BOOT0.3 BTN_NRST.4 BTN_NRST.3
BT_CS
  Top 0.406: U2.7 21.09,27.8 R1.1
BT_INT  (via drill 0.38)
  Top 0.254: U1.24 23.71,18.37 24.38,19.05 v24.38,19.68 | v24.38,26.42 24.38,26.54 23.88,27.05 22.72,27.05 U2.8
  Bottom 0.254: v24.38,19.68 v24.38,26.42
BT_MISO  (via drill 0.38)
  Top 0.254: U1.22 24.41,17.68 25.91,19.18 v25.91,19.68 25.91,19.81 26.21,20.12 30.53,20.12 T5.1 | v25.91,28.57 25.91,28.7 25.4,29.21 U2.5
  Bottom 0.254: v25.91,19.68 v25.91,28.57
BT_MOSI  (via drill 0.38)
  Top 0.254: U1.23 24.1,18 25.15,19.05 v25.15,20.19 25.15,20.57 25.48,20.9 T4.1 | v25.15,27.18 25.15,27.94 24.64,28.45 22.73,28.45 U2.6
  Bottom 0.254: v25.15,20.19 v25.15,27.18
BT_SCK  (via drill 0.38)
  Top 0.254: U1.21 24.79,17.29 v26.67,19.18 26.8,19.18 27.33,19.71 30.58,19.71 T3.1 | v26.67,29.21 26.67,29.59 26.42,29.84 22.73,29.84 U2.4
  Bottom 0.254: v26.67,19.18 v26.67,29.21
BTN_BACK  (via drill 0.38)
  Top 0.254: v13.21,18.54 13.72,18.52 U1.43
  Bottom 0.254: BTN_BACK.2 BTN_BACK.1 2.49,33.19 R15.2 12.28,33.19 12.7,32.77 12.7,31.5 12.45,31.24 10.41,31.24 8.13,28.96 8.13,23.62 v13.21,18.54 12.7,19.05
BTN_BOOT0  (via drill 0.38)
  Top 0.254: U1.60 arc45 16.65,9.21 14.99,7.54 5.26,7.54 arc-45 5.08,7.62 v3.81,8.89
  Bottom 0.254: BTN_BOOT0.2 BTN_BOOT0.1 3.68,10.2 R14.2 v3.81,8.89
BTN_DN  (via drill 0.38)
  Top 0.254: U1.26 21.59,17.65 v21.59,17.27
  Bottom 0.254: R16.2 34.39,4.23 | 34.39,4.23 BTN_DN.2 | 34.39,4.23 34.39,7.77 BTN_DN.1 34.54,7.92 34.54,16.76 34.04,17.27 v21.59,17.27
BTN_NRST  (via drill 0.38)
  Top 0.254: v20.83,11.68 21.25,11.68 U1.7
  Bottom 0.254: BTN_NRST.2 BTN_NRST.1 3.78,4.2 R13.2 4.74,4.23 5.08,4.57 5.08,6.35 5.59,6.86 7.62,6.86 8.13,7.37 8.13,13.46 8.64,13.97 18.54,13.97 v20.83,11.68
BTN_SEL  (via drill 0.38)
  Top 0.254: U1.27 22.65,19.34 21.34,18.03 v20.83,18.03
  Bottom 0.254: BTN_SEL.2 34.15,19.47 R18.2 33.02,18.29 32.51,17.78 25.91,17.78 25.65,18.03 v20.83,18.03 | BTN_SEL.2 BTN_SEL.1 | BTN_SEL.2 34.42,19.18
BTN_UP  (via drill 0.38)
  Top 0.254: U1.28 22.29,19.75 21.59,19.05 v21.08,19.05
  Bottom 0.254: BTN_UP.1 BTN_UP.2 | BTN_UP.2 32.91,33.2 R17.2 | BTN_UP.2 34.59,33.08 34.59,24.64 34.09,24.13 32.26,24.13 31.75,23.62 31.75,18.54 31.5,18.29 26.16,18.29 25.65,18.8 21.84,18.8 21.59,19.05 v21.08,19.05
D+  (via drill 0.38)
  Top 0.254: v14.99,15.49 14.99,15.83 U1.45
  Bottom 0.254: RN1.1 9.07,21.15 14.73,15.49 v14.99,15.49
D-  (via drill 0.38)
  Top 0.254: v16,14.73 16,15.52 U1.44
  Bottom 0.254: RN1.2 9.11,20.35 14.73,14.73 v16,14.73
G_INT  (via drill 0.38)
  Top 0.254: U5.2 17.83,37.85 18.54,37.85 18.91,37.48 R9.1 19.6,37.34 20.57,37.34 20.83,37.08 v20.83,36.83 | U1.39 15.24,19.81 v15.24,20.07
  Bottom 0.254: v15.24,20.07 17.53,20.07 21.34,24.13 21.34,36.32 v20.83,36.83
GND  (via drill 0.38)
  Top 0.254: U1.63 arc-45 17.78,8.21 18.19,8.61 | U11.15 15.2,26.98 U11.16 | U8.2 24.27,7.47 U9.2 24.38,7.58 24.38,7.37 | 24.13,7.37 24.38,7.37 | 24.38,7.37 24.64,7.11
  other vias: 17.53,12.7 20.83,13.46 24.13,13.46 21.34,15.75 10.16,13.21 33.02,22.86 23.11,20.83 19.05,29.46 18.29,15.75 18.29,18.29 23.62,15.75 15.75,21.34 6.86,23.37 16.76,25.65 19.05,32 19.05,35.31 29.72,19.05 29.72,5.84 29.72,2.54 17.27,4.32 6.6,5.59 6.6,2.79 3.81,2.79 13.21,2.54 17.27,2.54 23.88,2.54 33.02,2.54 29.21,24.89 29.21,27.94 5.33,29.21 20.57,39.88 8.13,18.8
  pour Top (isolate 0.1, rank 5): 0,0 37,0 36.82,40.64 33.53,40.64 33.5,35.97 21.82,35.97 21.84,40.64 -0.03,40.64
  pour Bottom (isolate 0.1): 36.83,0 -0.17,0 -0.11,40.72 21.84,40.64 21.82,35.97 33.5,35.97 33.53,40.64 36.83,40.75
GREEN
  Top 0.254: R25.1 13.7,8.34 U1.57
ID
  Bottom 0.254: U10.3 6.33,21 RN1.4
IMU_INT
  Top 0.254: U11.14 14.7,25.62 14.48,25.4 13.97,25.4 13.46,24.89 13.46,20.89 U1.40
IMU_NRESET
  Top 0.254: U11.11 13.2,25.65 12.95,25.4 12.7,25.4 12.19,24.89 12.19,24.51 R22.2 12.14,24.43 12.95,23.62 12.95,20.69 U1.41
N$1
  Bottom 0.254: U3.P$22 15.16,7.67 R4.2
N$2
  Bottom 0.254: U3.P$26 13.16,7.53 C14.2
N$3
  Top 0.254: U11.17 R10.1
N$4
  Top 0.254: U11.9 12.2,25.66 11.94,25.4 10.92,25.4 10.67,25.15 10.67,24.46 C4.2
N$5
  Top 0.406: U4.1 32.2,13.31 L1.P$2 30.01,11.46 D2.A
N$6
  Bottom 0.254: U3.P$5 23.66,7.02 23.14,7.54 23.14,8.02 R5.2
N$7
  Bottom 0.254: R5.1 22.86,10.98 D1.A
N$8
  Top 0.406: U4.3 34.27,12.12 R6.1 34.54,11.79 33.35,11.79 C8.2 R7.2
N$9
  Top 0.254: U5.3 U5.4
N$10
  Bottom 0.254: U10.2 RN1.3
N$11
  Bottom 0.254: D1.C 27.07,11.95 D3.A
N$13
  Top 0.254: U11.5 8.76,27.09 R12.2
N$14
  Top 0.254: U11.6 9.13,26.18 R11.2
N$16
  Top 0.254: R23.2 D4.A
N$18
  Top 0.254: R24.2 D5.A
N$19
  Top 0.254: R25.2 D6.A
N$27
  Top 0.254: U1.31 21.23,20.85 21.61,21.23 21.64,21.23 21.74,21.34 21.74,22.17 C27.1
N$29
  Top 0.254: U1.47 13.17,16.24 12.62,16.79 12.11,16.79 C28.1
OLED_BS0
  Bottom 0.254: U3.P$17 17.66,7.45 R2.2
OLED_CS
  Bottom 0.254: U3.P$19 16.66,7.73 R19.2
OLED_DC  (via drill 0.38)
  Top 0.254: U1.62 14.48,5.59 v14.48,4.57
  Bottom 0.254: v14.48,4.57 15.47,4.57 16.15,5.26 U3.P$20
OLED_MOSI  (via drill 0.38)
  Top 0.254: v16,12.95 15.48,12.95 U1.53
  Bottom 0.254: U3.P$13 19.66,11.32 19.3,11.68 16.26,11.68 16,11.94 v16,12.95
OLED_RES  (via drill 0.38)
  Top 0.254: U1.61 v13.46,5.28
  Bottom 0.254: v13.46,5.28 14.17,5.28 14.48,5.59 15.49,5.59 15.67,5.77 15.67,6.43 U3.P$21
OLED_SCK  (via drill 0.38)
  Top 0.254: v14.73,13.21 14.32,13.21 U1.51
  Bottom 0.254: U3.P$14 19.16,10.81 19.05,10.92 15.49,10.92 14.73,11.68 v14.73,13.21
OSC32_IN
  Top 0.254: U1.3 21.59,8.49 22.12,7.95 22.12,7.75 21.87,7.49 21.87,6.83 U8.3
OSC_IN
  Top 0.254: U1.5 22.29,9.16 22.38,9.16 23.01,8.53 23.56,8.53 U9.1
PROG
  Top 0.406: U6.5 2.4,32.81 R20.2
RED
  Top 0.254: R23.1 8.13,9.65 8.64,10.16 14.1,10.16 U1.55
SCL  (via drill 0.38)
  Top 0.254: U5.7 15.88,37.98 v15.49,37.49 | U11.19 16.24,28.59 | 16.24,28.59 16.25,28.7 | 16.25,28.7 v16.26,29.21 | U1.34 17.27,21.34 17.27,21.59 17.53,21.84 17.53,23.62 17.27,23.88 16.78,23.88 R3.1 | 16.24,28.59 17.39,28.59 17.53,28.45 17.53,26.16 | 17.53,26.16 17.53,24.88 R3.1 | 16.51,28.7 16.26,28.96 | 16.26,28.96 16,28.7 | 16.26,28.96 16.26,28.71 16.25,28.7 | T2.1 17.63,26.26 17.53,26.16 | U12.P$7 3.79,24.4 7.11,21.08 v11.68,21.08 | v14.22,21.08 14.22,23.62 14.73,24.13 16.61,24.13 R3.1
  Bottom 0.254: v15.49,37.49 15.49,29.72 v16.26,29.21 | v11.68,21.08 v14.22,21.08
SDA  (via drill 0.38)
  Top 0.254: U5.1 18.2,38.95 18.8,38.35 v20.57,38.35 | v16.76,29.97 15.67,29.97 U11.20 | U1.35 17.37,20.48 16.76,21.08 16.76,22.73 R8.1 15.56,22.79 v15.49,22.86 | T1.1 v17.37,33.78 | v9.14,24.64 8.89,24.38 4.83,24.38 4.24,24.97 U12.P$8
  Bottom 0.254: v20.57,38.35 17.27,38.35 16.76,37.85 16.76,33.78 | 16.76,33.78 v16.76,29.97 17.78,28.96 17.78,23.37 17.27,22.86 v15.49,22.86 15.24,22.61 10.67,22.61 9.14,24.13 v9.14,24.64 | v17.37,33.78 16.76,33.78
SWCLK
  Top 0.254: U1.49 12.82,13.07 10.41,10.67 8.13,10.67 7.11,9.65 JP2.4
SWDIO
  Top 0.254: U1.46 10.97,19.15 10.26,19.15 8.38,17.27 8.38,12.7 7.87,12.19 JP2.3
VBAT
  Top 0.254: 6.86,33.02 6.1,33.02 5.84,32.77 5.84,30.99 5.08,30.23 4.15,30.23 C30.1 3.79,29.87 U12.P$2 U12.P$3
  Top 0.406: C17.1 C15.1 9.82,34.2 U7.1 8.68,33.07 8.64,33.02 6.86,33.02 6.86,34.12 U7.3 6.78,35.36 | 6.78,35.56 6.78,38.28 JP1.2 | U6.3 6.61,35.73 6.78,35.56 | 6.78,36.17 6.35,35.74 6.76,35.33 6.78,35.36 | 6.78,35.56 6.78,35.36
VCOMH1
  Bottom 0.254: U3.P$3 24.66,6.88 24.66,7.11 25.04,7.49 25.04,8.19 C6.1
VUSB  (via drill 0.38)
  Top 0.305: v0.76,27.69 0.76,36.83 1.02,37.08 2.04,37.08 | 2.04,37.08 C16.1 | 2.04,37.08 2.04,36.09 U6.4
  Bottom 0.305: U10.1 7.2,19.7 7.26,19.76 7.26,21.95 7.11,22.1 5.84,22.1 5.59,22.35 5.59,26.92 5.33,27.18 1.27,27.18 v0.76,27.69
YELLOW
  Top 0.254: R24.1 9.65,9.4 9.91,9.65 14.3,9.65 U1.56

### Text on the board
Document: ECE 477 Group 4 / Rev 1.1 / Designed by / Nick Molo / John Lee / Harry Jung / Josh Wroblewski
tDocu: +